# Altium project Project Board Test SOM AM625.PrjPcb (part 2 of 7)

## Sheet DCDC.SchDoc
size A3; DocumentNumber: 2; SheetNumber: 2; SheetTotal: 12
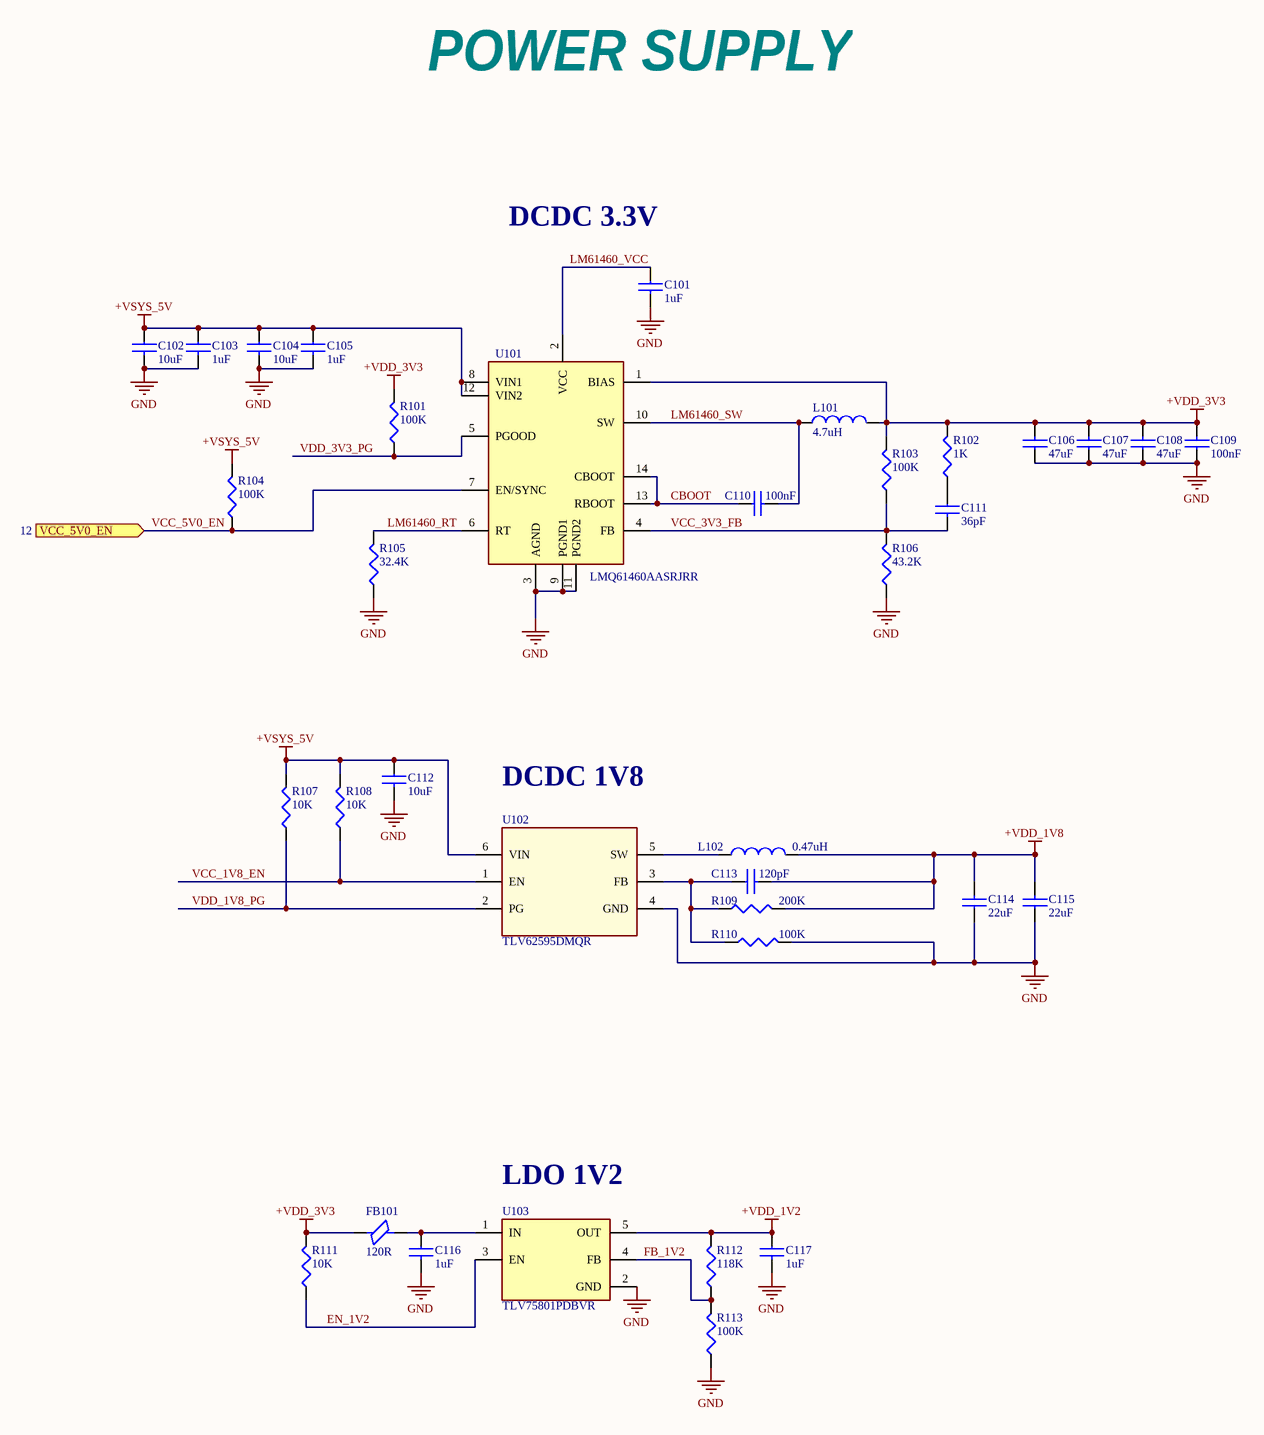
[diagram p1: DCDC.SchDoc]

### Parts
C101  1uF  [C0603]
C102  10uF  [C1206B/3216MM]
C103  1uF  [C0603]
C104  10uF  [C1206B/3216MM]
C105  1uF  [C0603]
C106  47uF  [C1206B/3216MM]
C107  47uF  [C1206B/3216MM]
C108  47uF  [C1206B/3216MM]
C109  100nF  [C0603]
C110  100nF  [C0603]
C111  36pF  [C0402]
C112  10uF  [C0603]
C113  120pF  [C0402]
C114  22uF  [C0805]
C115  22uF  [C0805]
C116  1uF  [C0402]
C117  1uF  [C0402]
FB101  120R  [FB0402]
L101  4.7uH  [IND_WE-XHMI_8080_WRE]
L102  0.47uH  [l2016]
R101  100K  [R0402]
R102  1K  [R0402]
R103  100K  [R0402]
R104  100K  [R0402]
R105  32.4K  [R0402]
R106  43.2K  [R0402]
R107  10K  [R0402]
R108  10K  [R0402]
R109  200K  [R0402]
R110  100K  [R0402]
R111  10K  [R0402]
R112  118K  [R0402]
R113  100K  [R0402]
U101  LMQ61460AASRJRR  [14-VFQFN]
U102  TLV62595DMQR  [VSON6_0D5_1D5X1D5X1MM]
U103  TLV75801PDBVR  [SOT23-5]

### Ports
VCC_5V0_EN (in, see 12)

### Nets
+VDD_1V2: C117.1 R112.2 U103.5(OUT)
+VDD_1V8: C113.2 C114.2 C115.2 L102.2 R109.2
+VDD_3V3: C106.2 C107.2 C108.2 C109.2 FB101.1 L101.2 R101.2 R102.2 R103.2 R111.2 U101.1(BIAS)
+VSYS_5V: C102.1 C103.1 C104.1 C105.1 C112.1 R104.2 R107.2 R108.2 U101.8(VIN1) U101.12(VIN2) U102.6(VIN)
GND: C101.2 C102.2 C103.2 C104.2 C105.2 C106.1 C107.1 C108.1 C109.1 C112.2 C114.1 C115.1 C116.2 C117.2 R105.1 R106.1 R110.2 R113.1 U101.3(AGND) U101.9(PGND1) U101.11(PGND2) U102.4(GND) U103.2(GND)
CBOOT: C110.1 U101.13(RBOOT) U101.14(CBOOT)
EN_1V2: R111.1 U103.3(EN)
FB_1V2: R112.1 R113.2 U103.4(FB)
LM61460_RT: R105.2 U101.6(RT)
LM61460_SW: C110.2 L101.1 U101.10(SW)
LM61460_VCC: C101.1 U101.2(VCC)
VCC_1V8_EN: R108.1 U102.1(EN)
VCC_3V3_FB: C111.2 R103.1 R106.2 U101.4(FB)
VCC_5V0_EN: R104.1 U101.7(EN/SYNC) ; port VCC_5V0_EN
VDD_1V8_PG: R107.1 U102.2(PG)
VDD_3V3_PG: R101.1 U101.5(PGOOD)
NetC111_1: C111.1 R102.1
NetC113_1: C113.1 R109.1 R110.1 U102.3(FB)
NetC116_1: C116.1 FB101.2 U103.1(IN)
NetL102_1: L102.1 U102.5(SW)

### Notes on the sheet
- POWER SUPPLY
- (near C101) DCDC 3.3V
- DCDC 1V8
- (near U103) LDO 1V2

### Library data of the parts
C101 C103 C105 = CGA3E1X5R1C105K080AC: Multilayer Ceramic Capacitor, 1 uF, 16 V, ± 10%, X5R, 0603 [1608 Metric]; Manufacturer: TDK; Material: 4241ConductorMaterial; Voltage Rating: 16V; Supplier 1: Digi-Key; Manufacturer Part Number: CGA3E1X5R1C105K080AC; RoHS: Yes; Category: Ceramic Capacitors; Stock 1: 37719; Pricing 1: 1=0.11, 10=0.072, 50=0.0432, 100=0.034, 500=0.02514, 1000=0.02081 (USD); Mount: Surface Mount; Case/Package: 0603; Case Code (Metric): 1608; Case Code (Imperial): 0603; Weight: 7.1E-05oz; Min Operating Temperature: -55°C; Max Operating Temperature: 85°C; Package Quantity: 4000; Packaging: Tape and Reel; Capacitance: 1uF; Tolerance: 10%; Dielectric: X5R; Termination: SMD/SMT; Voltage Rating (DC): 16V; Series: CGA; Length: 1.6mm; Width: 0.8mm; Height: 0.8mm; Ratings: AEC-Q200; RoHS Compliant: Yes; Lead Free: 5697LeadFree; ComponentLink1URL: http://www.farnell.com/datasheets/1936565.pdf?src-supplier=Farnell; ComponentLink1Description: http://www.farnell.com/datasheets/1936565.pdf?src-supplier=Farnell; ComponentLink2URL: https://product.tdk.com/info/en/documents/chara_sheet/CGA3E1X5R1C105K080AC.pdf?src-supplier=Digi-Key; ComponentLink2Description: https://product.tdk.com/info/en/documents/chara_sheet/CGA3E1X5R1C105K080AC.pdf?src-supplier=Digi-Key; ComponentLink3URL: https://product.tdk.com/info/en/catalog/datasheets/mlcc_automotive_general_en.pdf?ref_disty=digikey&src-supplier=Digi-Key; ComponentLink3Description: https://product.tdk.com/info/en/catalog/datasheets/mlcc_automotive_general_en.pdf?ref_disty=digikey&src-supplier=Digi-Key; ComponentLink4URL: https://datasheet.octopart.com/CGA3E1X5R1C105K080AC-TDK-datasheet-43366117.pdf?src-supplier=Newark; ComponentLink4Description: https://datasheet.octopart.com/CGA3E1X5R1C105K080AC-TDK-datasheet-43366117.pdf?src-supplier=Newark; ComponentLink5URL: http://product.tdk.com/capacitor/mlcc/detailed_information.php?lang=en&ref=jp&part_no=CGA3E1X5R1C105K080AC&src-supplier=Mouser; ComponentLink5Description: http://product.tdk.com/capacitor/mlcc/detailed_information.php?lang=en&ref=jp&part_no=CGA3E1X5R1C105K080AC&src-supplier=Mouser; ComponentLink6URL: http://product.tdk.com/en/catalog/datasheets/mlcc_automotive_general_en.pdf?src-supplier=Avnet; ComponentLink6Description: http://product.tdk.com/en/catalog/datasheets/mlcc_automotive_general_en.pdf?src-supplier=Avnet; Supplier Part Number 1: 445-12457-1-ND
C102 C104 = C3216X5R1C106K160AA: Multilayer Ceramic Capacitor, 10 uF, 16 V, ± 10%, X5R, 1206 [3216 Metric]; Manufacturer: TDK; Material: 4241ConductorMaterial; Supplier 1: Digi-Key; Manufacturer Part Number: C3216X5R1C106K160AA; RoHS: Yes; Category: Ceramic Capacitors; Stock 1: 12091; Pricing 1: 1=0.3, 10=0.194, 50=0.136, 100=0.1098, 500=0.08158, 1000=0.07138 (USD); ComponentLink1URL: https://datasheet.ciiva.com/24216/c3216x5r1c106k160aa-265031-24216373.pdf?src-supplier=Mouser; ComponentLink1Description: https://datasheet.ciiva.com/24216/c3216x5r1c106k160aa-265031-24216373.pdf?src-supplier=Mouser; ComponentLink2URL: https://datasheet.ciiva.com/11788/0900766b80c1bb00-11788199.pdf?src-supplier=Rs; ComponentLink2Description: https://datasheet.ciiva.com/11788/0900766b80c1bb00-11788199.pdf?src-supplier=Rs; ComponentLink3URL: https://datasheet.ciiva.com/16384/e413-c-16384539.pdf?src-supplier=Future+Electronics; ComponentLink3Description: https://datasheet.ciiva.com/16384/e413-c-16384539.pdf?src-supplier=Future+Electronics; ComponentLink4URL: https://datasheet.ciiva.com/15192/getdatasheetpartid-726778-15192219.pdf?src-supplier=Verical; ComponentLink4Description: https://datasheet.ciiva.com/15192/getdatasheetpartid-726778-15192219.pdf?src-supplier=Verical; ComponentLink5URL: https://datasheet.ciiva.com/6289/tdkmlcccaprange-6289816.pdf?src-supplier=Digi-Key; ComponentLink5Description: https://datasheet.ciiva.com/6289/tdkmlcccaprange-6289816.pdf?src-supplier=Digi-Key; ComponentLink6URL: https://datasheet.ciiva.com/6289/tdkmlcccaprange-6289819.pdf?src-supplier=Digi-Key; ComponentLink6Description: https://datasheet.ciiva.com/6289/tdkmlcccaprange-6289819.pdf?src-supplier=Digi-Key; ComponentLink7URL: https://datasheet.ciiva.com/6191/1571323-6191005.pdf?src-supplier=Farnell; ComponentLink7Description: https://datasheet.ciiva.com/6191/1571323-6191005.pdf?src-supplier=Farnell; ComponentLink8URL: https://datasheet.ciiva.com/7770/1571323-7770223.pdf?src-supplier=Element14; ComponentLink8Description: https://datasheet.ciiva.com/7770/1571323-7770223.pdf?src-supplier=Element14; ComponentLink9URL: https://datasheet.ciiva.com/28451/1796654-28451976.pdf?src-supplier=Element14; ComponentLink9Description: https://datasheet.ciiva.com/28451/1796654-28451976.pdf?src-supplier=Element14; ComponentLink10URL: https://datasheet.ciiva.com/22719/1796654-22719558.pdf?src-supplier=Element14; ComponentLink10Description: https://datasheet.ciiva.com/22719/1796654-22719558.pdf?src-supplier=Element14; Supplier Part Number 1: 445-4052-1-ND
C106-C108 = C3216X5R1C476M160AB: Multilayer Ceramic Capacitor, 47 uF, 16 V, ± 20%, X5R, 1206 [3216 Metric]; Manufacturer: TDK; Material: 4241ConductorMaterial; Voltage Rating: 16V; Supplier 1: Digi-Key; Manufacturer Part Number: C3216X5R1C476M160AB; RoHS: Yes; Category: Ceramic Capacitors; Stock 1: 94632; Pricing 1: 1=0.97, 10=0.7, 50=0.6118, 100=0.4985, 500=0.40788, 1000=0.35123 (USD); Mount: Surface Mount; Case/Package: 1206; Case Code (Imperial): 1206; Case Code (Metric): 3216; Dielectric Material: Ceramic; Min Operating Temperature: -55°C; Max Operating Temperature: 85°C; Capacitance: 47uF; Tolerance: 20%; Packaging: Tape and Reel; Dielectric: X5R; Series: C; Construction: Flat; Length: 3.2mm; Height: 1.6mm; Depth: 1.6mm; Lead Free: Lead Free; RoHS Compliant: Yes; Reach SVHC Compliant: Unknown; ComponentLink1URL: https://datasheet.ciiva.com/22725/1913358-22725583.pdf?src-supplier=Element14; ComponentLink1Description: https://datasheet.ciiva.com/22725/1913358-22725583.pdf?src-supplier=Element14; ComponentLink2URL: https://datasheet.ciiva.com/22725/1913358-22725581.pdf?src-supplier=Element14; ComponentLink2Description: https://datasheet.ciiva.com/22725/1913358-22725581.pdf?src-supplier=Element14; ComponentLink3URL: https://datasheet.ciiva.com/6285/tdkmlcccaprange-6285563.pdf?src-supplier=Digi-Key; ComponentLink3Description: https://datasheet.ciiva.com/6285/tdkmlcccaprange-6285563.pdf?src-supplier=Digi-Key; ComponentLink4URL: https://datasheet.ciiva.com/6285/tdkmlcccaprange-6285560.pdf?src-supplier=Digi-Key; ComponentLink4Description: https://datasheet.ciiva.com/6285/tdkmlcccaprange-6285560.pdf?src-supplier=Digi-Key; ComponentLink5URL: https://datasheet.ciiva.com/6285/tdkmlcccaprange-6285566.pdf?src-supplier=Digi-Key; ComponentLink5Description: https://datasheet.ciiva.com/6285/tdkmlcccaprange-6285566.pdf?src-supplier=Digi-Key; ComponentLink6URL: https://datasheet.ciiva.com/24471/2972c3216x5r1c476m160ab-24471351.pdf?src-supplier=Onlinecomponents.com; ComponentLink6Description: https://datasheet.ciiva.com/24471/2972c3216x5r1c476m160ab-24471351.pdf?src-supplier=Onlinecomponents.com; ComponentLink7URL: https://datasheet.ciiva.com/16426/mlcc-commercial-general-en-16426989.pdf?src-supplier=Future+Electronics; ComponentLink7Description: https://datasheet.ciiva.com/16426/mlcc-commercial-general-en-16426989.pdf?src-supplier=Future+Electronics; Supplier Part Number 1: 445-6003-1-ND
C109 C110 = C1608X7R1E104K080AA: Multilayer Ceramic Capacitor, 0.1 uF, 25 V, ± 10%, X7R, 0603 [1608 Metric]; Manufacturer: TDK; Material: 4241ConductorMaterial; Voltage Rating: 25V; Supplier 1: Arrow Electronics; Manufacturer Part Number: C1608X7R1E104K080AA; RoHS: Yes; Category: Ceramic Capacitors; Stock 1: 20; Pricing 1: 1=0.0528, 10=0.0066 (USD); Mount: Surface Mount; Case/Package: 0603; Number of Pins: 2NUMBER; Case Code (Imperial): 0603; Case Code (Metric): 1608; Dielectric Material: 4241ConductorMaterial; Min Operating Temperature: -55°C; Max Operating Temperature: 125°C; Capacitance: 100nF; Tolerance: 10%; Dielectric: X7R; Packaging: Tape and Reel; Package Quantity: 4000; Voltage: 25V; Series: C; Construction: Flat; Length: 1.6mm; Width: 0.031inch; Height: 0.8mm; Thickness: 0.037inch; Depth: 0.8mm; Reach SVHC Compliant: No; RoHS Compliant: Yes; Lead Free: 5697LeadFree; ComponentLink1URL: https://datasheet.ciiva.com/22749/1744655-22749596.pdf?src-supplier=Element14; ComponentLink1Description: https://datasheet.ciiva.com/22749/1744655-22749596.pdf?src-supplier=Element14; ComponentLink2URL: https://datasheet.ciiva.com/6250/tdkmlcccaprange-6250455.pdf?src-supplier=Digi-Key; ComponentLink2Description: https://datasheet.ciiva.com/6250/tdkmlcccaprange-6250455.pdf?src-supplier=Digi-Key; ComponentLink3URL: https://datasheet.ciiva.com/6250/tdkmlcccaprange-6250454.pdf?src-supplier=Digi-Key; ComponentLink3Description: https://datasheet.ciiva.com/6250/tdkmlcccaprange-6250454.pdf?src-supplier=Digi-Key; ComponentLink4URL: https://datasheet.ciiva.com/6250/tdkmlcccaprange-6250456.pdf?src-supplier=Digi-Key; ComponentLink4Description: https://datasheet.ciiva.com/6250/tdkmlcccaprange-6250456.pdf?src-supplier=Digi-Key; Supplier Part Number 1: C1608X7R1E104K080AA
C111 = CC0402FRNPO9BN360: Capacitor Ceramic 36pF 50V C0G 1% 0402 Paper T/R; Manufacturer: Yageo; Supplier 1: Digi-Key; Manufacturer Part Number: CC0402FRNPO9BN360; RoHS: No; Category: Ceramic Capacitors; Stock 1: 9940; Pricing 1: 1=0.1, 10=0.048, 50=0.0278, 100=0.0215, 500=0.0162, 1000=0.01272, 2500=0.01156, 5000=0.01064 (USD); Supplier Part Number 1: 13-CC0402FRNPO9BN360CT-ND
C112 = C1608X5R1A106K080AC: Multilayer Ceramic Capacitor, 10 uF, 10 V, ± 10%, X5R, 0603 [1608 Metric]; Manufacturer: TDK; Material: 4241ConductorMaterial; Voltage Rating (DC): 10V; Supplier 1: Arrow Electronics; Manufacturer Part Number: C1608X5R1A106K080AC; RoHS: Yes; Category: Ceramic Capacitors; Stock 1: 3399; Pricing 1: 1=0.263, 10=0.156, 25=0.1544, 50=0.1444, 100=0.1124, 250=0.1113, 500=0.1094, 1000=0.0748, 3000=0.0665 (USD); Mount: Surface Mount; Case/Package: 0603; Number of Pins: 2; Dielectric Material: Ceramic; Case Code (Imperial): 0603; Case Code (Metric): 1608; Weight: 7.1E-05oz; Min Operating Temperature: -55°C; Max Operating Temperature: 85°C; Capacitance: 10uF; Tolerance: 10%; Dielectric: X5R; Packaging: Tape and Reel; Voltage Rating: 10V; Package Quantity: 1; Termination: SMD/SMT; Voltage: 10V; Series: C; Construction: Flat; Length: 1.6mm; Width: 0.031inch; Height: 0.8mm; Depth: 0.8mm; Thickness: 0.035inch; Lead Free: Lead Free; Reach SVHC Compliant: No; RoHS Compliant: Yes; ComponentLink1URL: https://datasheet.ciiva.com/23802/1796654-23802763.pdf?src-supplier=Newark; ComponentLink1Description: https://datasheet.ciiva.com/23802/1796654-23802763.pdf?src-supplier=Newark; ComponentLink2URL: https://datasheet.ciiva.com/7975/1796654-7975065.pdf?src-supplier=Element14; ComponentLink2Description: https://datasheet.ciiva.com/7975/1796654-7975065.pdf?src-supplier=Element14; ComponentLink3URL: https://datasheet.ciiva.com/22694/1796654-22694118.pdf?src-supplier=Element14; ComponentLink3Description: https://datasheet.ciiva.com/22694/1796654-22694118.pdf?src-supplier=Element14; ComponentLink4URL: https://datasheet.ciiva.com/28577/mlcc-commercial-general-en-28577085.pdf?src-supplier=Element14; ComponentLink4Description: https://datasheet.ciiva.com/28577/mlcc-commercial-general-en-28577085.pdf?src-supplier=Element14; ComponentLink5URL: https://datasheet.ciiva.com/28577/1744655-28577071.pdf?src-supplier=Element14; ComponentLink5Description: https://datasheet.ciiva.com/28577/1744655-28577071.pdf?src-supplier=Element14; ComponentLink6URL: https://datasheet.ciiva.com/6288/tdkmlcccaprange-6288222.pdf?src-supplier=Digi-Key; ComponentLink6Description: https://datasheet.ciiva.com/6288/tdkmlcccaprange-6288222.pdf?src-supplier=Digi-Key; ComponentLink7URL: https://datasheet.ciiva.com/6288/tdkmlcccaprange-6288220.pdf?src-supplier=Digi-Key; ComponentLink7Description: https://datasheet.ciiva.com/6288/tdkmlcccaprange-6288220.pdf?src-supplier=Digi-Key; ComponentLink8URL: https://datasheet.ciiva.com/6288/tdkmlcccaprange-6288223.pdf?src-supplier=Digi-Key; ComponentLink8Description: https://datasheet.ciiva.com/6288/tdkmlcccaprange-6288223.pdf?src-supplier=Digi-Key; ComponentLink9URL: https://datasheet.ciiva.com/16449/mlcc-commercial-general-en-16449573.pdf?src-supplier=Future+Electronics; ComponentLink9Description: https://datasheet.ciiva.com/16449/mlcc-commercial-general-en-16449573.pdf?src-supplier=Future+Electronics; ComponentLink10URL: https://datasheet.ciiva.com/48671/e412-c-48671301.pdf?src-supplier=Avnet; ComponentLink10Description: https://datasheet.ciiva.com/48671/e412-c-48671301.pdf?src-supplier=Avnet; Supplier Part Number 1: C1608X5R1A106K080AC
C113 = C0402C121J3GAC7867: Cap Ceramic 120pF 25V C0G 5% SMD 0402 125°C Paper T/R; Manufacturer: KEMET; Supplier 1: Digi-Key; Manufacturer Part Number: C0402C121J3GAC7867; RoHS: Yes; Category: Ceramic Capacitors; Stock 1: 88769; Pricing 1: 1=0.1, 10=0.033, 50=0.0188, 100=0.0146, 500=0.01096, 1000=0.00861, 2500=0.00783, 5000=0.0072 (USD); ComponentLink1URL: https://api.kemet.com/component-edge/download/datasheet/C0402C121J3GAC7867.pdf?src-supplier=Digi-Key; ComponentLink1Description: https://api.kemet.com/component-edge/download/datasheet/C0402C121J3GAC7867.pdf?src-supplier=Digi-Key; Supplier Part Number 1: 399-14880-1-ND
C114 C115 = CC0805MKX5R8BB226: 22 µF ±20% 25V Ceramic Capacitor X5R 0805 (2012 Metric); Manufacturer: Yageo; Material: 4241ConductorMaterial; Supplier 1: Future Electronics; Manufacturer Part Number: CC0805MKX5R8BB226; RoHS: Yes; Category: Ceramic Capacitors; Stock 1: 10; Pricing 1: 1=0.375, 15=0.3, 75=0.255, 300=0.215, 1500=0.172 (USD); ComponentLink1URL: http://www.mouser.com/ds/2/447/Yageo_UPY-GP_NP0_16V-to-50V_9-358835.pdf?src-supplier=Mouser; ComponentLink1Description: http://www.mouser.com/ds/2/447/Yageo_UPY-GP_NP0_16V-to-50V_9-358835.pdf?src-supplier=Mouser; ComponentLink2URL: https://datasheet.octopart.com/CC0805MKX5R8BB226-Yageo-datasheet-137700085.pdf?src-supplier=Future+Electronics; ComponentLink2Description: https://datasheet.octopart.com/CC0805MKX5R8BB226-Yageo-datasheet-137700085.pdf?src-supplier=Future+Electronics; ComponentLink3URL: http://www.yageo.com/documents/recent/UPY-GPHC_X5R_4V-to-50V_25.pdf?src-supplier=Digi-Key; ComponentLink3Description: http://www.yageo.com/documents/recent/UPY-GPHC_X5R_4V-to-50V_25.pdf?src-supplier=Digi-Key; Supplier Part Number 1: 1151527
C116 C117 = CC0402KRX5R6BB105: Multilayer Ceramic Capacitor, 1 uF, 16 V, ± 20%, C0G (NP0), 0201 [0603 Metric]; Manufacturer: Yageo; Tolerance: 10%; Dielectric: X5R; Voltage Rating: 10V; Dissipation Factor: 15%; Temperature Coefficient: 30ppm/°C; Supplier 1: Future Electronics; Manufacturer Part Number: CC0402KRX5R6BB105; RoHS: Yes; Category: Ceramic Capacitors; Stock 1: 11730000; Pricing 1: 10000=0.0105, 30000=0.0101, 50000=0.0098, 100000=0.0095, 200000=0.0091 (USD); Mount: Surface Mount; Case/Package: 0402; Number of Pins: 2; Case Code (Metric): 1005; Case Code (Imperial): 0402; Min Operating Temperature: -55°C; Max Operating Temperature: 85°C; Capacitance: 1uF; Package Quantity: 1; Packaging: Tape and Reel; Voltage Rating (DC): 10V; Termination: SMD/SMT; Series: CC; Construction: Flat; Length: 1mm; Width: 0.02inch; Height: 0.5mm; Thickness: 0.022inch; Depth: 0.5mm; Radiation Hardening: No; Reach SVHC Compliant: No; RoHS Compliant: Yes; ComponentLink1URL: https://datasheet.ciiva.com/176/upy-gphc-x5r-4v-to-50v-12-176704.pdf?src-supplier=Digi-Key; ComponentLink1Description: https://datasheet.ciiva.com/176/upy-gphc-x5r-4v-to-50v-12-176704.pdf?src-supplier=Digi-Key; ComponentLink2URL: https://datasheet.ciiva.com/176/mlccorderingcode-176705.pdf?src-supplier=Digi-Key; ComponentLink2Description: https://datasheet.ciiva.com/176/mlccorderingcode-176705.pdf?src-supplier=Digi-Key; ComponentLink3URL: https://datasheet.ciiva.com/176/mlccorderingcode-176706.pdf?src-supplier=Digi-Key; ComponentLink3Description: https://datasheet.ciiva.com/176/mlccorderingcode-176706.pdf?src-supplier=Digi-Key; Supplier Part Number 1: 7826878
FB101 = BLM15PD121SZ1D: Ferrite Beads Multi-Layer 120Ohm 25% 100MHz 1.3A 0.09Ohm DCR 0402 Automotive T/R; Manufacturer: Murata; Core Material: 228ConductorMaterial; Number of Lines: 1; Resistance: 90mR; Supplier 1: Arrow Electronics; Manufacturer Part Number: BLM15PD121SZ1D; RoHS: Yes; Category: Ferrite Beads and Chips; Stock 1: 10000; Pricing 1: 10000=0.0178, 20000=0.0168, 30000=0.016, 50000=0.0158 (USD); Mount: Surface Mount; Case/Package: 0402; Case Code (Imperial): 0402; Case Code (Metric): 1005; Min Operating Temperature: -55°C; Max Operating Temperature: 125°C; Packaging: Cut Tape; Max Current Rating: 1.3A; Series: EMIFIL®, BLM15; RMS Current (Irms): 1.3A; Series Resistance: 90mR; Test Frequency: 100MHz; Tolerance: 25%; Height: 550um; Ratings: AEC-Q200; RoHS Compliant: Yes; ComponentLink1URL: https://www.murata.com/en-us/products/productdata/8796748677150/QNFA9118.pdf?src-supplier=Digi-Key; ComponentLink1Description: https://www.murata.com/en-us/products/productdata/8796748677150/QNFA9118.pdf?src-supplier=Digi-Key; Supplier Part Number 1: BLM15PD121SZ1D
L101 = 74439358047: Fixed Ind 4.7UH 9.5A 8.65 Mohm; Manufacturer: Wurth Electronics; Core Material: Ferrite,Metal,Composite; Saturation Current: 20.5A; Shielding: Shielded; DC Resistance (DCR): 8.65mR; Self Resonant Frequency: 25MHz; Test Frequency: 100kHz; Tolerance: 20%; Supplier 1: Digi-Key; Manufacturer Part Number: 74439358047; RoHS: Yes; Category: Fixed Inductors; Stock 1: 2723; Pricing 1: 1=4.69, 50=4.048, 100=3.49, 250=3.06 (USD); Mount: Surface Mount; Case/Package: Nonstandard; Min Operating Temperature: -40°C; Max Operating Temperature: 125°C; Packaging: Cut Tape; Inductance: 4.7uH; Current Rating: 9.5A; RMS Current (Irms): 9.5A; Inductance Tolerance: 20%; Series: WE-XHMI; Length: 0.346inch; Width: 0.327inch; Height - Seated (Max): 0.315inch; RoHS Compliant: Yes; Reach SVHC Compliant: Unknown; ComponentLink1URL: http://www.farnell.com/datasheets/1951867.pdf?src-supplier=Farnell; ComponentLink1Description: http://www.farnell.com/datasheets/1951867.pdf?src-supplier=Farnell; ComponentLink2URL: http://www.farnell.com/datasheets/1951867.pdf?src-supplier=Element14; ComponentLink2Description: http://www.farnell.com/datasheets/1951867.pdf?src-supplier=Element14; ComponentLink3URL: https://katalog.we-online.de/pbs/datasheet/74439358047.pdf?src-supplier=Digi-Key; ComponentLink3Description: https://katalog.we-online.de/pbs/datasheet/74439358047.pdf?src-supplier=Digi-Key; Supplier Part Number 1: 732-7275-1-ND
L102 = DFE201610E-R47M=P2: Inductor Power Shielded Wirewound 0.47uH 20% 1MHz Metal 3.6A 0.032Ohm DCR 0806 T/R; Manufacturer: Murata; Inductance: 470nH; Saturation Current: 4.8A; Series Resistance: 32mR; Supplier 1: Digi-Key; Manufacturer Part Number: DFE201610E-R47M=P2; RoHS: Yes; Category: Fixed Inductors; Stock 1: 21073; Pricing 1: 1=0.32, 10=0.261, 25=0.2412, 50=0.221, 100=0.1948, 250=0.1888, 500=0.16872, 1000=0.13658 (USD); Min Operating Temperature: -40°C; Max Operating Temperature: 125°C; Current Rating: 3.6A; Inductance Tolerance: 20%; Packaging: 13Packaging; RMS Current (Irms): 3.6A; Test Frequency: 1MHz; Tolerance: 20%; Height: 1mm; RoHS Compliant: Yes; ComponentLink1URL: http://www.farnell.com/datasheets/2339713.pdf?src-supplier=Farnell; ComponentLink1Description: http://www.farnell.com/datasheets/2339713.pdf?src-supplier=Farnell; ComponentLink2URL: https://datasheet.octopart.com/DFE201610E-R47M%3DP2-Murata-datasheet-90967093.pdf?src-supplier=Element14; ComponentLink2Description: https://datasheet.octopart.com/DFE201610E-R47M%3DP2-Murata-datasheet-90967093.pdf?src-supplier=Element14; ComponentLink3URL: http://search.murata.co.jp/Ceramy/image/img/P02/J(E)TE243A-0001_DFE201610E_reference.pdf?src-supplier=Digi-Key; ComponentLink3Description: http://search.murata.co.jp/Ceramy/image/img/P02/J(E)TE243A-0001_DFE201610E_reference.pdf?src-supplier=Digi-Key; ComponentLink4URL: https://datasheet.octopart.com/DFE201610E-R47M%3DP2-Murata-datasheet-150009017.pdf?src-supplier=Arrow.cn; ComponentLink4Description: https://datasheet.octopart.com/DFE201610E-R47M%3DP2-Murata-datasheet-150009017.pdf?src-supplier=Arrow.cn; Supplier Part Number 1: 490-18109-1-ND
R101 R103 R104 = RC0402FR-07100KL: SMD Chip Resistor, 100 kOhm, ± 1%, 63 mW, 0402 [1005 Metric], Thick Film, General Purpose; Manufacturer: Yageo; Resistance: 100kR; Temperature Coefficient: 100ppm/°C; Power Rating: 63mW; Voltage Rating: 50V; Supplier 1: Future Electronics; Manufacturer Part Number: RC0402FR-07100KL; RoHS: Yes; Category: Chip SMD Resistors; Stock 1: 57860000; Pricing 1: 10000=0.0008, 50000=0.0008, 250000=0.0007, 500000=0.0007, 1500000=0.0007 (USD); Case/Package: 0402; Case Code (Metric): 1005; Case Code (Imperial): 0402; Min Operating Temperature: -55°C; Max Operating Temperature: 155°C; Resistor Type: Thick Film; Tolerance: 1%; Packaging: Tape and Reel; Package Quantity: 1; Number of Terminations: 2; Termination: SMD/SMT; Max Power Dissipation: 63mW; Features: Moisture Resistant; Series: RC; Resistance Tolerance: 1%; Construction: Rectangular; Technology: THICK FILM; Voltage Rating (AC): 50V; Length: 0.039inch; Width: 0.02inch; Height: 0.016inch; Depth: 0.5mm; Reach SVHC Compliant: No; RoHS Compliant: Yes; Lead Free: 5697LeadFree; Military Standard: Not; ComponentLink1URL: https://datasheet.ciiva.com/11819/0900766b80c66297-11819452.pdf?src-supplier=Rs; ComponentLink1Description: https://datasheet.ciiva.com/11819/0900766b80c66297-11819452.pdf?src-supplier=Rs; ComponentLink2URL: https://datasheet.ciiva.com/22747/1018594-22747509.pdf?src-supplier=Element14; ComponentLink2Description: https://datasheet.ciiva.com/22747/1018594-22747509.pdf?src-supplier=Element14; ComponentLink3URL: https://datasheet.ciiva.com/2453/pyu-r-int-thick-7-2453362.pdf?src-supplier=Digi-Key; ComponentLink3Description: https://datasheet.ciiva.com/2453/pyu-r-int-thick-7-2453362.pdf?src-supplier=Digi-Key; ComponentLink4URL: https://datasheet.ciiva.com/2453/pyu-r-int-thick-7-2453363.pdf?src-supplier=Digi-Key; ComponentLink4Description: https://datasheet.ciiva.com/2453/pyu-r-int-thick-7-2453363.pdf?src-supplier=Digi-Key; ComponentLink5URL: https://datasheet.ciiva.com/2453/pyu-r-int-thick-7-2453361.pdf?src-supplier=Digi-Key; ComponentLink5Description: https://datasheet.ciiva.com/2453/pyu-r-int-thick-7-2453361.pdf?src-supplier=Digi-Key; ComponentLink6URL: https://datasheet.ciiva.com/12667/pyu-rc0402-51-rohs-l-6-r-12667930.pdf?src-supplier=Mouser; ComponentLink6Description: https://datasheet.ciiva.com/12667/pyu-rc0402-51-rohs-l-6-r-12667930.pdf?src-supplier=Mouser; ComponentLink7URL: https://datasheet.ciiva.com/15189/getdatasheetpartid-323696-15189334.pdf?src-supplier=Verical; ComponentLink7Description: https://datasheet.ciiva.com/15189/getdatasheetpartid-323696-15189334.pdf?src-supplier=Verical; Supplier Part Number 1: 6468466
R102 = RC0402FR-071KL: SMD Chip Resistor, 1 kOhm, ± 1%, 63 mW, 0402 [1005 Metric], Thick Film, General Purpose; Manufacturer: Yageo; Resistance: 1kR; Temperature Coefficient: 100ppm/°C; Voltage Rating (DC): 50V; Power Rating: 62.5mW; Max Power Dissipation: 63mW; Supplier 1: Future Electronics; Manufacturer Part Number: RC0402FR-071KL; RoHS: Yes; Category: Chip SMD Resistors; Stock 1: 37960000; Pricing 1: 10000=0.0008, 50000=0.0008, 250000=0.0007, 500000=0.0007, 1500000=0.0007 (USD); Case/Package: 0402; Number of Pins: 2; Case Code (Imperial): 0402; Case Code (Metric): 1005; Size Code: 0402; Min Operating Temperature: -55°C; Max Operating Temperature: 155°C; Resistor Type: Thick Film; Tolerance: 1%; Packaging: Tape and Reel; Voltage Rating: 50V; Termination: SMD/SMT; Features: Moisture Resistant; Series: RC; Number of Terminations: 2; Resistance Tolerance: 1%; Construction: Rectangular; Technology: THICK FILM; Voltage Rating (AC): 50V; Length: 1mm; Width: 0.5mm; Height: 0.32mm; Depth: 0.5mm; Reach SVHC Compliant: No; RoHS Compliant: Yes; Military Standard: Not; ComponentLink1URL: https://datasheet.ciiva.com/11819/0900766b80c66297-11819477.pdf?src-supplier=Rs; ComponentLink1Description: https://datasheet.ciiva.com/11819/0900766b80c66297-11819477.pdf?src-supplier=Rs; ComponentLink2URL: https://datasheet.ciiva.com/7983/1018594-7983502.pdf?src-supplier=Element14; ComponentLink2Description: https://datasheet.ciiva.com/7983/1018594-7983502.pdf?src-supplier=Element14; ComponentLink3URL: https://datasheet.ciiva.com/22747/1018594-22747513.pdf?src-supplier=Element14; ComponentLink3Description: https://datasheet.ciiva.com/22747/1018594-22747513.pdf?src-supplier=Element14; ComponentLink4URL: https://datasheet.ciiva.com/12666/pyu-rc0402-51-rohs-l-6-r-12666741.pdf?src-supplier=Mouser; ComponentLink4Description: https://datasheet.ciiva.com/12666/pyu-rc0402-51-rohs-l-6-r-12666741.pdf?src-supplier=Mouser; ComponentLink5URL: https://datasheet.ciiva.com/7849/1018594-7849869.pdf?src-supplier=Element14; ComponentLink5Description: https://datasheet.ciiva.com/7849/1018594-7849869.pdf?src-supplier=Element14; ComponentLink6URL: https://datasheet.ciiva.com/7849/1018594-7849871.pdf?src-supplier=Element14; ComponentLink6Description: https://datasheet.ciiva.com/7849/1018594-7849871.pdf?src-supplier=Element14; ComponentLink7URL: https://datasheet.ciiva.com/17063/pyu-rc0402-51-rohs-l-6-r-17063193.pdf?src-supplier=Future+Electronics; ComponentLink7Description: https://datasheet.ciiva.com/17063/pyu-rc0402-51-rohs-l-6-r-17063193.pdf?src-supplier=Future+Electronics; Supplier Part Number 1: 7825607
R105 = RC0402FR-0732K4L: SMD Chip Resistor, 32.4 kOhm, ± 1%, 63 mW, 0402 [1005 Metric], Thick Film, General Purpose; Manufacturer: Yageo; Supplier 1: Future Electronics; Manufacturer Part Number: RC0402FR-0732K4L; RoHS: Yes; Category: Chip SMD Resistors; Stock 1: 90000; Pricing 1: 10000=0.0008, 50000=0.0008, 250000=0.0007, 500000=0.0007, 1500000=0.0007 (USD); ComponentLink1URL: https://datasheet.ciiva.com/12558/pyu-rc0402-51-rohs-l-6-r-8721-12558541.pdf?src-supplier=Mouser; ComponentLink1Description: https://datasheet.ciiva.com/12558/pyu-rc0402-51-rohs-l-6-r-8721-12558541.pdf?src-supplier=Mouser; ComponentLink2URL: https://datasheet.ciiva.com/16743/pyu-rc0402-51-rohs-l-6-r-16743927.pdf?src-supplier=Future+Electronics; ComponentLink2Description: https://datasheet.ciiva.com/16743/pyu-rc0402-51-rohs-l-6-r-16743927.pdf?src-supplier=Future+Electronics; ComponentLink3URL: https://datasheet.ciiva.com/8889/pyu-rc0402-51-rohs-l-6-8889597.pdf?src-supplier=Avnet; ComponentLink3Description: https://datasheet.ciiva.com/8889/pyu-rc0402-51-rohs-l-6-8889597.pdf?src-supplier=Avnet; Supplier Part Number 1: 4331021
R106 = RC0402FR-0743K2L: SMD Chip Resistor, 43.2 kOhm, ± 1%, 63 mW, 0402 [1005 Metric], Thick Film, General Purpose; Manufacturer: Yageo; Voltage Rating (DC): 50V; Supplier 1: Future Electronics; Manufacturer Part Number: RC0402FR-0743K2L; RoHS: Yes; Category: Chip SMD Resistors; Stock 1: 300000; Pricing 1: 10000=0.0007, 100000=0.0006, 400000=0.0006, 1250000=0.0006, 4000000=0.0005 (USD); Lead Free: 5697LeadFree; ComponentLink1URL: https://datasheet.ciiva.com/2519/pyu-r-int-thick-7-2519030.pdf?src-supplier=Digi-Key; ComponentLink1Description: https://datasheet.ciiva.com/2519/pyu-r-int-thick-7-2519030.pdf?src-supplier=Digi-Key; ComponentLink2URL: https://datasheet.ciiva.com/2519/pyu-r-int-thick-7-2519031.pdf?src-supplier=Digi-Key; ComponentLink2Description: https://datasheet.ciiva.com/2519/pyu-r-int-thick-7-2519031.pdf?src-supplier=Digi-Key; ComponentLink3URL: https://datasheet.ciiva.com/2519/pyu-r-int-thick-7-2519032.pdf?src-supplier=Digi-Key; ComponentLink3Description: https://datasheet.ciiva.com/2519/pyu-r-int-thick-7-2519032.pdf?src-supplier=Digi-Key; ComponentLink4URL: https://datasheet.ciiva.com/17070/pyu-rc0402-51-rohs-l-6-r-17070574.pdf?src-supplier=Future+Electronics; ComponentLink4Description: https://datasheet.ciiva.com/17070/pyu-rc0402-51-rohs-l-6-r-17070574.pdf?src-supplier=Future+Electronics; Supplier Part Number 1: 9101908
R107 R108 R111 = RC0402FR-0710KL: RES 10.0K OHM 1/16W 1% 0402 SMD; Manufacturer: Yageo; Power (Watts): 0.063W, 1/16W; .Checked PCB: used; Temperature Coefficient: ±100ppm/°C; Category: Resistors; Supplier Part Number: 311-10.0KLRCT-ND; Manufacturer Part Number: RC0402FR-0710KL; Package / Case: 0402 (1005 Metric); Price 1k [$]: 0.01421; Resistance (Ohms): 10K; Tolerance: ±1%; Value: 10k; .Checked SCH: used; Supplier: Digikey; Supplier 1: Digi-Key; Supplier Part Number 1: 311-10.0KLRCT-ND; RoHS: RoHS Compliant; Stock 1: 2916495; Pricing 1: 10=0.014, 50=0.0104, 100=0.0079, 250=0.00584, 500=0.00432, 1000=0.00288 (USD); Composition: Thick Film; Features: -; Size / Dimension: 0.039" L x 0.020" W (1.00mm x 0.50mm); Height: 0.016" (0.40mm); Number of Terminations: 2; Packaging: Cut Tape (CT); ComponentLink1URL: http://www.yageo.com/documents/recent/PYu-RC0402_51_RoHS_L_6.pdf; ComponentLink1Description: http://www.yageo.com/documents/recent/PYu-RC0402_51_RoHS_L_6.pdf
R109 = RC0402FR-07200KL: SMD Chip Resistor, 200 kOhm, ± 1%, 63 mW, 0402 [1005 Metric], Thick Film, General Purpose; Manufacturer: Yageo; Power Rating: 63mW; Temperature Coefficient: 100ppm/°C; Resistance: 200kR; Voltage Rating: 50V; Supplier 1: Future Electronics; Manufacturer Part Number: RC0402FR-07200KL; RoHS: Yes; Category: Chip SMD Resistors; Stock 1: 4220000; Pricing 1: 10000=0.0008, 50000=0.0008, 250000=0.0007, 500000=0.0007, 1500000=0.0007 (USD); Case/Package: 0402; Case Code (Metric): 1005; Case Code (Imperial): 0402; Min Operating Temperature: -55°C; Max Operating Temperature: 155°C; Tolerance: 1%; Packaging: Tape and Reel; Termination: SMD/SMT; Series: RC; Technology: THICK FILM; Package Quantity: 1; Resistor Type: Thick Film; Number of Terminations: 2; Max Power Dissipation: 63mW; Working Voltage: 50V; Features: Moisture Resistant; Construction: Rectangular; Resistance Tolerance: 1%; Voltage Rating (DC): 50V; Length: 0.039inch; Width: 0.02inch; Height: 0.016inch; Depth: 0.5mm; RoHS Compliant: Yes; Military Standard: Not; Reach SVHC Compliant: Unknown; Lead Free: 5697LeadFree; ComponentLink1URL: https://datasheet.ciiva.com/7849/1018594-7849897.pdf?src-supplier=Element14; ComponentLink1Description: https://datasheet.ciiva.com/7849/1018594-7849897.pdf?src-supplier=Element14; ComponentLink2URL: https://datasheet.ciiva.com/7849/1018594-7849896.pdf?src-supplier=Element14; ComponentLink2Description: https://datasheet.ciiva.com/7849/1018594-7849896.pdf?src-supplier=Element14; ComponentLink3URL: https://datasheet.ciiva.com/46394/1018594-46394953.pdf?src-supplier=Element14; ComponentLink3Description: https://datasheet.ciiva.com/46394/1018594-46394953.pdf?src-supplier=Element14; ComponentLink4URL: https://datasheet.ciiva.com/2453/pyu-r-int-thick-7-2453557.pdf?src-supplier=Digi-Key; ComponentLink4Description: https://datasheet.ciiva.com/2453/pyu-r-int-thick-7-2453557.pdf?src-supplier=Digi-Key; ComponentLink5URL: https://datasheet.ciiva.com/2453/pyu-r-int-thick-7-2453558.pdf?src-supplier=Digi-Key; ComponentLink5Description: https://datasheet.ciiva.com/2453/pyu-r-int-thick-7-2453558.pdf?src-supplier=Digi-Key; ComponentLink6URL: https://datasheet.ciiva.com/2453/pyu-r-int-thick-7-2453556.pdf?src-supplier=Digi-Key; ComponentLink6Description: https://datasheet.ciiva.com/2453/pyu-r-int-thick-7-2453556.pdf?src-supplier=Digi-Key; ComponentLink7URL: https://datasheet.ciiva.com/12667/pyu-rc0402-51-rohs-l-6-r-12667911.pdf?src-supplier=Mouser; ComponentLink7Description: https://datasheet.ciiva.com/12667/pyu-rc0402-51-rohs-l-6-r-12667911.pdf?src-supplier=Mouser; ComponentLink8URL: https://datasheet.ciiva.com/15189/getdatasheetpartid-323720-15189381.pdf?src-supplier=Verical; ComponentLink8Description: https://datasheet.ciiva.com/15189/getdatasheetpartid-323720-15189381.pdf?src-supplier=Verical; ComponentLink9URL: https://datasheet.ciiva.com/16740/pyu-rc0402-51-rohs-l-6-r-16740636.pdf?src-supplier=Future+Electronics; ComponentLink9Description: https://datasheet.ciiva.com/16740/pyu-rc0402-51-rohs-l-6-r-16740636.pdf?src-supplier=Future+Electronics; Supplier Part Number 1: 2059442
R110 R113 = AC0402FR-07100KL: SMD Chip Resistor, 100 kOhm, ± 1%, 63 mW, 0402 [1005 Metric], Thick Film, General Purpose; Manufacturer: Yageo; Resistance: 100kR; Power Rating: 62.5mW; Voltage Rating: 50V; Max Power Dissipation: 63mW; Temperature Coefficient: 100ppm/°C; Supplier 1: Future Electronics; Manufacturer Part Number: AC0402FR-07100KL; RoHS: Yes; Category: Chip SMD Resistors; Stock 1: 3080000; Pricing 1: 10000=0.0013, 50000=0.0012, 200000=0.0011, 500000=0.0011, 1250000=0.001 (USD); Case/Package: 0402; Case Code (Imperial): 0402; Case Code (Metric): 1005; Size Code: 0402; Min Operating Temperature: -55°C; Max Operating Temperature: 155°C; Tolerance: 1%; Packaging: Tape and Reel; Number of Terminations: 2; Termination: SMD/SMT; Features: Moisture Resistant,Automotive AEC-Q200; Series: AC; Length: 0.039inch; Width: 0.5mm; Height: 0.015inch; RoHS Compliant: Yes; Lead Free: 5697LeadFree; ComponentLink1URL: http://www.yageo.com/documents/recent/PYu-AC_51_RoHS_L_2.pdf?src-supplier=Mouser; ComponentLink1Description: http://www.yageo.com/documents/recent/PYu-AC_51_RoHS_L_2.pdf?src-supplier=Mouser; ComponentLink2URL: https://datasheet.octopart.com/AC0402FR-07100KL-Yageo-datasheet-166720450.pdf?src-supplier=Future+Electronics; ComponentLink2Description: https://datasheet.octopart.com/AC0402FR-07100KL-Yageo-datasheet-166720450.pdf?src-supplier=Future+Electronics; ComponentLink3URL: http://www.yageo.com/documents/recent/PYu-AC_51_RoHS_L_2_revised.pdf?src-supplier=Future+Electronics; ComponentLink3Description: http://www.yageo.com/documents/recent/PYu-AC_51_RoHS_L_2_revised.pdf?src-supplier=Future+Electronics; Supplier Part Number 1: 8025350
R112 = RC0402FR-07118KL: SMD Chip Resistor, 118 kOhm, ± 1%, 63 mW, 0402 [1005 Metric], Thick Film, General Purpose; Manufacturer: Yageo; Resistance: 118kR; Voltage Rating: 50V; Temperature Coefficient: 100ppm/°C; Power Rating: 62.5mW; Max Power Dissipation: 63mW; Supplier 1: Future Electronics; Manufacturer Part Number: RC0402FR-07118KL; RoHS: Yes; Category: Chip SMD Resistors; Stock 1: 540000; Pricing 1: 10000=0.0008, 50000=0.0008, 250000=0.0007, 500000=0.0007, 1500000=0.0007 (USD); Case/Package: 0402; Contact Plating: Tin,Matte; Case Code (Metric): 1005; Case Code (Imperial): 0402; Min Operating Temperature: -55°C; Max Operating Temperature: 155°C; Tolerance: 1%; Packaging: Tape and Reel; Package Quantity: 10000; Termination: SMD/SMT; Series: RC; Number of Terminations: 2; Features: Moisture Resistant; Construction: Rectangular; Voltage Rating (DC): 50V; Length: 1mm; Width: 0.5mm; Height: 0.016inch; Depth: 0.5mm; RoHS Compliant: Yes; Lead Free: 5697LeadFree; Military Standard: Not; ComponentLink1URL: https://datasheet.ciiva.com/2552/pyu-r-int-thick-7-2552967.pdf?src-supplier=Digi-Key; ComponentLink1Description: https://datasheet.ciiva.com/2552/pyu-r-int-thick-7-2552967.pdf?src-supplier=Digi-Key; ComponentLink2URL: https://datasheet.ciiva.com/8887/pyu-rc0402-51-rohs-l-6-8887658.pdf?src-supplier=Avnet; ComponentLink2Description: https://datasheet.ciiva.com/8887/pyu-rc0402-51-rohs-l-6-8887658.pdf?src-supplier=Avnet; ComponentLink3URL: https://datasheet.ciiva.com/12558/pyu-rc0402-51-rohs-l-6-r-8721-12558524.pdf?src-supplier=Mouser; ComponentLink3Description: https://datasheet.ciiva.com/12558/pyu-rc0402-51-rohs-l-6-r-8721-12558524.pdf?src-supplier=Mouser; ComponentLink4URL: https://datasheet.ciiva.com/26829/getdatasheetpartid-702380-26829882.pdf?src-supplier=Verical; ComponentLink4Description: https://datasheet.ciiva.com/26829/getdatasheetpartid-702380-26829882.pdf?src-supplier=Verical; Supplier Part Number 1: 4968004
U101 = LMQ61460AASRJRR: Industrial 3-V to 36-V, 6-A, low-noise synchronous step-down converter 14-VQFN-HR -40 to 150; Manufacturer: Texas Instruments; Supplier 1: Mouser; Manufacturer Part Number: LMQ61460AASRJRR; RoHS: No; Category: Voltage Regulators - Switching; Stock 1: 4057; Pricing 1: 1=4.4, 10=3.88, 50=3.88, 100=3.24, 1000=2.33, 10000=2.21 (USD); Supplier Part Number 1: 595-LMQ61460AASRJRR
U102 = TLV62595DMQR: 2.5-V to 5.5-V input, 4-A step-down converter with 1% output accuracy in 1.5-mm x 1.5-mm QFN package 6-VSON-HR -40 to...; Manufacturer: Texas Instruments; Supplier 1: Digi-Key; Manufacturer Part Number: TLV62595DMQR; RoHS: Yes; Category: Voltage Regulators - Switching; Stock 1: 8309; Pricing 1: 1=0.87, 10=0.767, 25=0.72, 100=0.5877, 250=0.54592, 500=0.4646, 1000=0.37168 (USD); Supplier Part Number 1: 296-TLV62595DMQRCT-ND
U103 = TLV75801PDBVR: Adjustable 500-mA low-dropout (LDO) regulator 5-SOT-23 -40 to 125; Manufacturer: Texas Instruments; Output Configuration: Positive; Max Input Voltage: 6V; Min Output Voltage: 550mV; Max Output Voltage: 5.5V; Output Current: 500mA; Power Supply Rejection Ratio (PSRR): 30dB; Number of Regulators: 1; Quiescent Current: 35uA; Accuracy: 0.7%; Dropout Voltage: 720mV; Min Supply Voltage: 1.5V; Nominal Supply Current: 25uA; Number of Channels: 1NUMBER; Supplier 1: Mouser; Manufacturer Part Number: TLV75801PDBVR; RoHS: Yes; Category: Voltage Regulators - Linear; Stock 1: 49798; Pricing 1: 1=0.35, 10=0.261, 50=0.261, 100=0.146, 1000=0.11, 10000=0.088 (USD); Mount: Surface Mount; Case/Package: SOT-23-5; Number of Pins: 5NUMBER; Min Operating Temperature: -40°C; Max Operating Temperature: 125°C; Output Type: Adjustable; Series: -; Max Supply Voltage: 6V; Number of Outputs: 1NUMBER; Length: 2.9mm; Width: 1.6mm; Height: 1.45mm; Thickness: 1.2mm; ComponentLink1URL: http://www.ti.com/general/docs/suppproductinfo.tsp?distId=10&amp;gotoUrl=http%3A%2F%2Fwww.ti.com%2Flit%2Fgpn%2Ftlv758p&src-supplier=Digi-Key; ComponentLink1Description: http://www.ti.com/general/docs/suppproductinfo.tsp?distId=10&amp;gotoUrl=http%3A%2F%2Fwww.ti.com%2Flit%2Fgpn%2Ftlv758p&src-supplier=Digi-Key; Supplier Part Number 1: 595-TLV75801PDBVR